# EAGLE design os23ac (EAGLE 9.6.2)
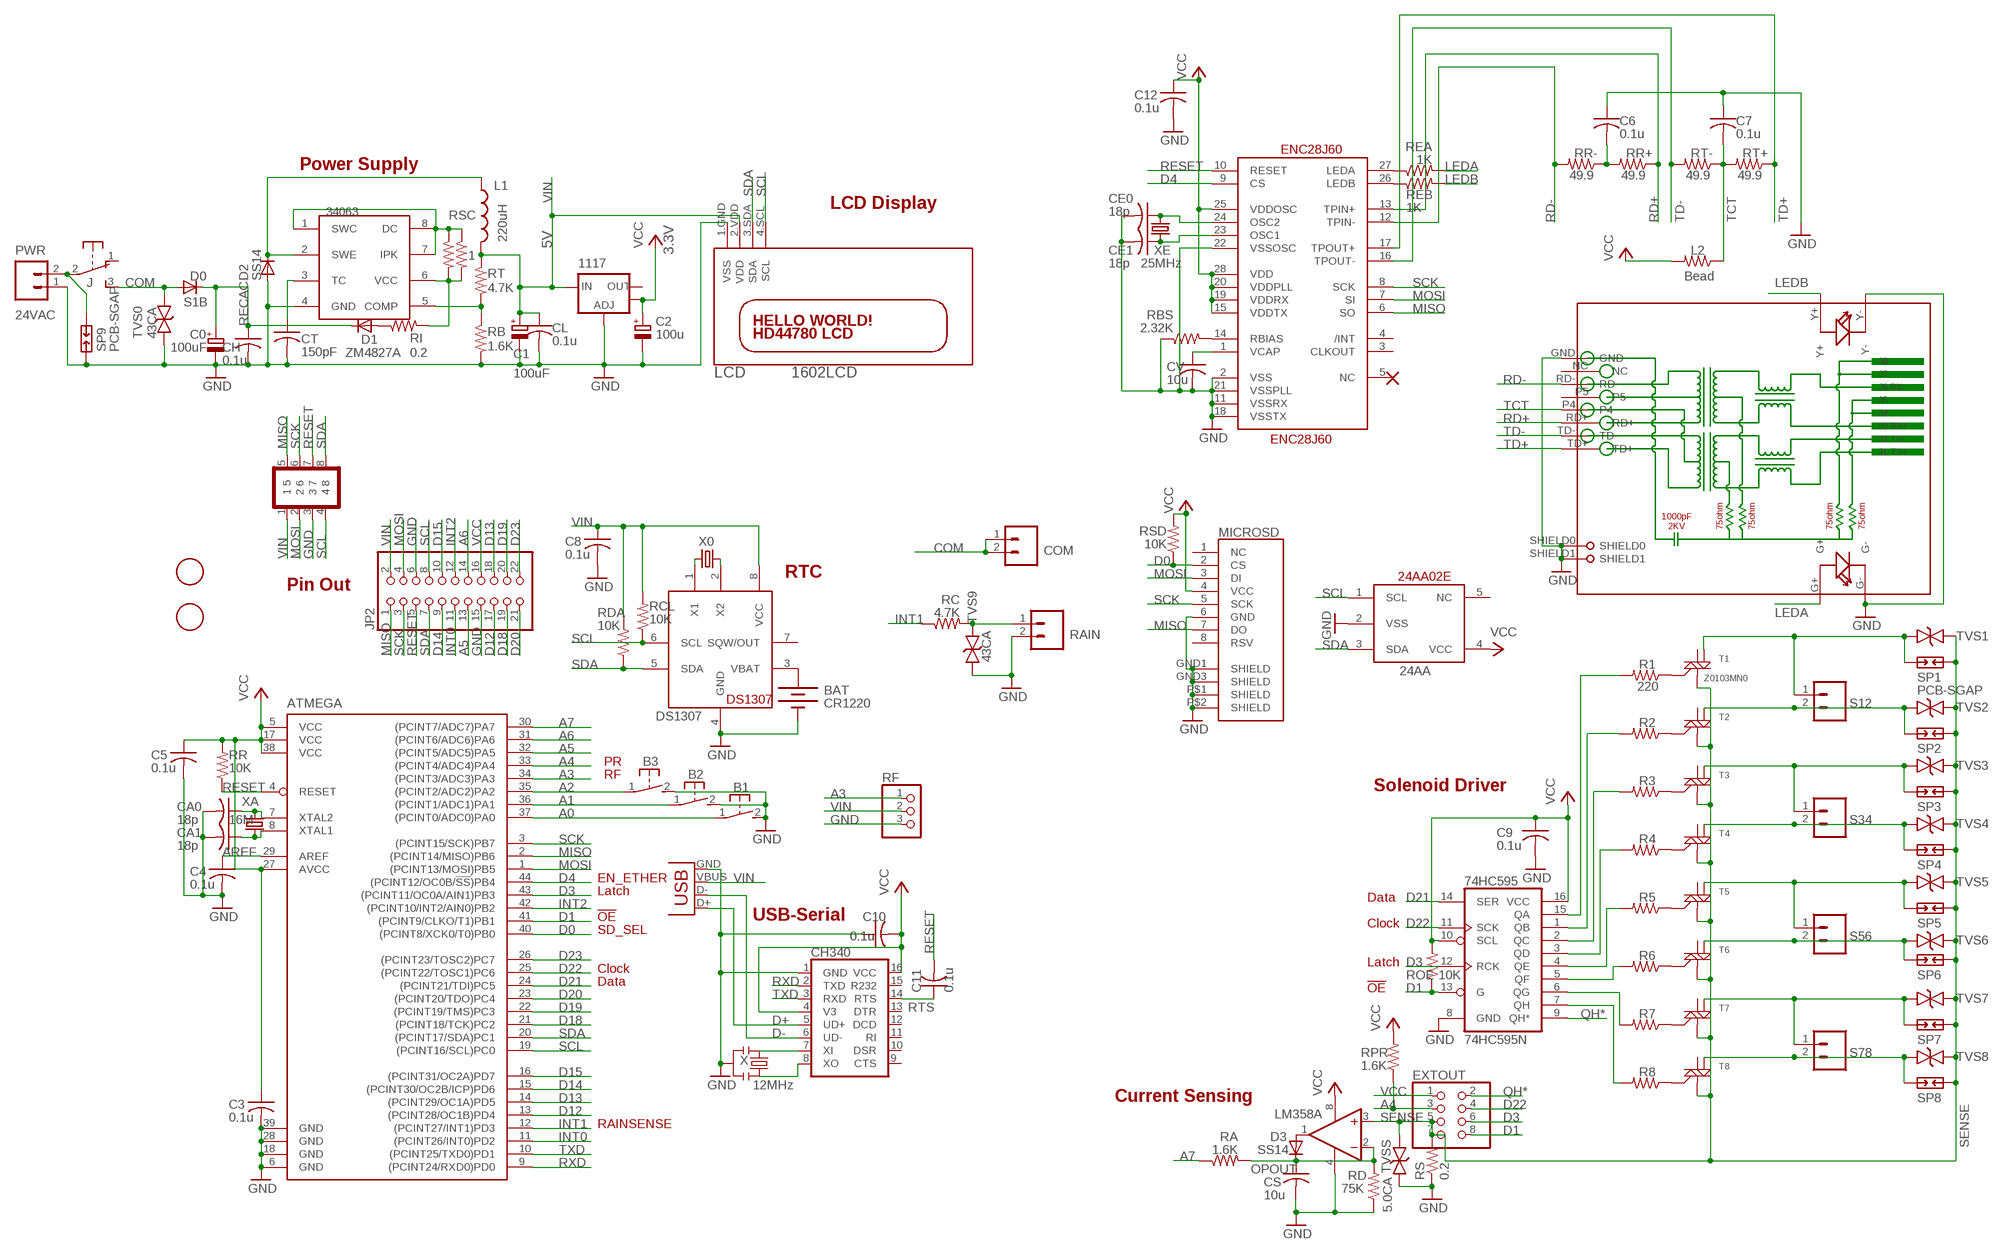
[diagram p0: schematic, sheet 1]

## Parts
24AA  24AA02E48  [SOT23-5L]
74HC595  74HC595N  74LS595D  [SO16]
1117  V_REG_LM1117SOT223  [SOT223]
34063  34063  MC33063/MC34063D  [SO08]
ATMEGA  ATMEGA644A  [TQFP44]
B1  31-XX  [B3F-31XX]
B2  31-XX  [B3F-31XX]
B3  31-XX  [B3F-31XX]
BAT  CR1220  BATTERYBATTERY_12MM_SMT  [BATTCON_12MM_SMT]
C0  100uF  CPOL-EUE  [PANASONIC_E]
C1  100uF  CPOL-EUD  [PANASONIC_D]
C2  100u  CPOL-EUD  [PANASONIC_D]
C3  0.1u  C-USC0603K  [C0603K]
C4  0.1u  C-USC0603  [C0603]
C5  0.1u  C-USC0603  [C0603]
C6  0.1u  C-USC0603  [C0603]
C7  0.1u  C-USC0603K  [C0603K]
C8  0.1u  C-USC0603  [C0603]
C9  0.1u  C-USC0603  [C0603]
C10  0.1u  C-USC0603  [C0603]
C11  0.1u  C-USC0603  [C0603]
C12  0.1u  C-USC0603  [C0603]
CA0  18p  C-USC0603K  [C0603K]
CA1  18p  C-USC0603K  [C0603K]
CE0  18p  C-USC0603K  [C0603K]
CE1  18p  C-USC0603K  [C0603K]
CH  0.1u  C-USC0603  [C0603]
CH340  CH340G  [SO16]
CL  0.1u  C-USC0603  [C0603]
COM  M025MM-X  [SCREWTERMINAL-5MM-2-X]
CS  10u  C-USC0805K  [C0805K]
CT  150pF  C-USC0603K  [C0603K]
CV  10u  C-USC0805K  [C0805K]
D0  S1B  DIODE-DO-214AC  [DO-214AC]
D1  ZM4827A  DIODE-MELF-MLL41  [MELF-MLL41]
D2  SS14  DIODE-DO-214AC  [DO-214AC]
D3  SS14  DIODE-DO-214AC  [DO-214AC]
DS1307  DS1307  DS1307SOIC  [SO08]
ENC28J60  ENC28J60SO28LONG  [SOIC28WLONG]
EXTOUT  PINHD-2X4  [2X04]
J  EG1206  [EG1206]
JP2  PINHD-2X11  [2X11]
L1  220uH  INDUCTORSRU1038  [SRU1038]
L2  Bead  R-US_R0805  [R0805]
LCD  1602LCD  HD44780LCD-I2CSIDE  [LCD1602-I2C-SIDE]
LM358  OP262D  [SO08]
MICROSD  USD-SOCKETMICRO-SD-SOCKET-TAOBAO  [MICRO-SD-SOCKET-TAOBAO]
PWR  24VAC  M024MM-X  [SCREWTERMINAL-4MM-2-X]
R1  220  R-US_R0603  [R0603]
R2  220  R-US_R0603  [R0603]
R3  220  R-US_R0603  [R0603]
R4  220  R-US_R0603  [R0603]
R5  220  R-US_R0603  [R0603]
R6  220  R-US_R0603  [R0603]
R7  220  R-US_R0603  [R0603]
R8  220  R-US_R0603  [R0603]
RA  1.6K  R-US_R0603  [R0603]
RAIN  M025MM-X  [SCREWTERMINAL-5MM-2-X]
RB  1.6K  R-US_R0603  [R0603]
RBS  2.32K  R-US_R0805  [R0805]
RC  4.7K  R-US_R0603  [R0603]
RCL  10K  R-US_R0603  [R0603]
RD  75K  R-US_R0603  [R0603]
RDA  10K  R-US_R0603  [R0603]
REA  1K  R-US_R0603  [R0603]
REB  1K  R-US_R0603  [R0603]
RF  PINHD-1X3  [1X03]
RI  0.2  R-US_R2512  [R2512]
RJ45  HR911105A  [HR911105A]
ROE  10K  R-US_R0603  [R0603]
RPR  1.6K  R-US_R0603  [R0603]
RR  10K  R-US_R0603  [R0603]
RR+  49.9  R-US_R0603  [R0603]
RR-  49.9  R-US_R0603  [R0603]
RS  0.2  R-US_R2512  [R2512]
RSC  1  R-US_R0805  [R0805]
RSC1  1  R-US_R0805  [R0805]
RSD  10K  R-US_R0603  [R0603]
RT  4.7K  R-US_R0805  [R0805]
RT+  49.9  R-US_R0603  [R0603]
RT-  49.9  R-US_R0603  [R0603]
S12  M025MM-X  [SCREWTERMINAL-5MM-2-X]
S34  M025MM-X  [SCREWTERMINAL-5MM-2-X]
S56  M025MM-X  [SCREWTERMINAL-5MM-2-X]
S78  M025MM-X  [SCREWTERMINAL-5MM-2-X]
SP1  PCB-SGAP  [PCB-SGAP]
SP2  PCB-SGAP  [PCB-SGAP]
SP3  PCB-SGAP  [PCB-SGAP]
SP4  PCB-SGAP  [PCB-SGAP]
SP5  PCB-SGAP  [PCB-SGAP]
SP6  PCB-SGAP  [PCB-SGAP]
SP7  PCB-SGAP  [PCB-SGAP]
SP8  PCB-SGAP  [PCB-SGAP]
SP9  PCB-SGAP  [PCB-SGAP]
T1  Z0103MN0  MAC97SOT223  [SOT223]
T2  Z0103MN  MAC97SOT223  [SOT223]
T3  Z0103MN  MAC97SOT223  [SOT223]
T4  Z0103MN  MAC97SOT223  [SOT223]
T5  Z0103MN  MAC97SOT223  [SOT223]
T6  Z0103MN  MAC97SOT223  [SOT223]
T7  Z0103MN  MAC97SOT223  [SOT223]
T8  Z0103MN  MAC97SOT223  [SOT223]
TVS0  43CA  DIODE-BTVSSMB  [SMB]
TVS1  40CA  DIODE-BTVSSMB  [SMB]
TVS2  40CA  DIODE-BTVSSMB  [SMB]
TVS3  40CA  DIODE-BTVSSMB  [SMB]
TVS4  40CA  DIODE-BTVSSMB  [SMB]
TVS5  40CA  DIODE-BTVSSMB  [SMB]
TVS6  40CA  DIODE-BTVSSMB  [SMB]
TVS7  40CA  DIODE-BTVSSMB  [SMB]
TVS8  40CA  DIODE-BTVSSMB  [SMB]
TVS9  43CA  DIODE-BTVSSMB  [SMB]
TVSS  5.0CA  DIODE-BTVSSMB  [SMB]
U$1  FIDUCIAL  [FIDUCIAL_1MM]
U$3  FIDUCIAL  [FIDUCIAL_1MM]
U$4  GOLDFINGER_2X4  [GOLDFINGER_2X4]
USB  USBPTH  [USB-B-PTH]
X  12MHz  RESONATORSMD  [RESONATOR-SMD]
X0  32.768kHz  CRYSTALMM20SS  [MM20SS]
XA  16M  CRYSTAL4SMD  [4SMD]
XE  25MHz  CRYSTAL4SMD  [4SMD]

## Nets
A0: ATMEGA.37((PCINT0/ADC0)PA0) B1.1(P)
A1: ATMEGA.36((PCINT1/ADC1)PA1) B2.1(P)
A2: ATMEGA.35((PCINT2/ADC2)PA2) B3.1(P)
A3: ATMEGA.34((PCINT3/ADC3)PA3) RF.1
A4: ATMEGA.33((PCINT4/ADC4)PA4) EXTOUT.3 RPR.1
A5: ATMEGA.32((PCINT5/ADC5)PA5) JP2.13
A6: ATMEGA.31((PCINT6/ADC6)PA6) JP2.14
A7: ATMEGA.30((PCINT7/ADC7)PA7) RA.1
AREF: ATMEGA.29(AREF) C4.1
COM [power]: COM.1 COM.2 D0.A J.3(S) TVS0.C
D0: ATMEGA.40((PCINT8/XCK0/T0)PB0) MICROSD.2(CS) RSD.1
D1: 74HC595.13(G) ATMEGA.41((PCINT9/CLKO/T1)PB1) EXTOUT.8 ROE.1
D3: 74HC595.12(RCK) ATMEGA.43((PCINT11/OC0A/AIN1)PB3) EXTOUT.6
D4: ATMEGA.44((PCINT12/OC0B/!SS!)PB4) ENC28J60.9(CS)
D12: ATMEGA.13((PCINT28/OC1B)PD4) JP2.17
D13: ATMEGA.14((PCINT29/OC1A)PD5) JP2.18
D14: ATMEGA.15((PCINT30/OC2B/ICP)PD6) JP2.9
D15: ATMEGA.16((PCINT31/OC2A)PD7) JP2.10
D18: ATMEGA.21((PCINT18/TCK)PC2) JP2.19
D19: ATMEGA.22((PCINT19/TMS)PC3) JP2.20
D20: ATMEGA.23((PCINT20/TDO)PC4) JP2.21
D21: 74HC595.14(SER) ATMEGA.24((PCINT21/TDI)PC5)
D22: 74HC595.11(SCK) ATMEGA.25((PCINT22/TOSC1)PC6) EXTOUT.4
D23: ATMEGA.26((PCINT23/TOSC2)PC7) JP2.22
D+: CH340.5(UD+) USB.D+
D-: CH340.6(UD-) USB.D-
GND: 24AA.2(VSS) 74HC595.8(GND) 1117.1(ADJ) 34063.4(GND) ATMEGA.6(GND) ATMEGA.18(GND) ATMEGA.28(GND) ATMEGA.39(GND) B1.2(S) B2.2(S) B3.2(S) BAT.P$1(-) C0.- C1.- C2.- C3.2 C4.2 C5.2 C6.1 C7.1 C8.2 C9.2 C10.1 C12.2 CA0.2 CA1.2 CE0.2 CE1.2 CH340.1(GND) CH.2 CL.2 CS.2 CT.2 CV.2 D2.A DS1307.4(GND) ENC28J60.2(VSS) ENC28J60.11(VSSRX) ENC28J60.18(VSSTX) ENC28J60.21(VSSPLL) ENC28J60.22(VSSOSC) JP2.6 JP2.15 LCD.1.GND(VSS) LM358.4(P:V-) MICROSD.6(GND) MICROSD.GND1(SHIELD) MICROSD.GND3(SHIELD) MICROSD.P$1(SHIELD) MICROSD.P$2(SHIELD) PWR.1 RAIN.2 RB.2 RBS.1 RD.1 RF.3 RJ45.G- RJ45.GND RJ45.SHIELD0 RJ45.SHIELD1 RJ45.Y- RS.1 SP9.2 TVS0.A TVS9.A TVSS.A U$4.3 USB.GND X.2
INT0: ATMEGA.11((PCINT26/INT0)PD2) JP2.11
INT1: ATMEGA.12((PCINT27/INT1)PD3) RC.1
INT2: ATMEGA.42((PCINT10/INT2/AIN0)PB2) JP2.12
LEDA: REA.2 RJ45.G+
LEDB: REB.2 RJ45.Y+
MISO: ATMEGA.2((PCINT14/MISO)PB6) ENC28J60.6(SO) JP2.1 MICROSD.7(DO) U$4.5
MOSI: ATMEGA.1((PCINT13/MOSI)PB5) ENC28J60.7(SI) JP2.4 MICROSD.3(DI) U$4.2
N$1 [power]: J.2(P) PWR.2 SP9.1
N$2 [power]: 34063.1(SWC) 34063.7(IPK) 34063.8(DC) RSC1.1 RSC.1
N$3: RAIN.1 RC.2 TVS9.C
N$4: 74HC595.5(QF) R6.2
N$5: 74HC595.6(QG) R7.2
N$6: CH340.7(XI) X.1
N$7: 74HC595.7(QH) R8.2
N$8: DS1307.1(X1) X0.1
N$9 [power]: 34063.2(SWE) D2.C L1.1
N$10: 74HC595.4(QE) R5.2
N$11: 74HC595.3(QD) R4.2
N$12: 74HC595.2(QC) R3.2
N$13: 74HC595.1(QB) R2.2
N$14: 74HC595.15(QA) R1.2
N$15: ATMEGA.7(XTAL2) CA0.1 XA.1
N$16 [power]: S12.1 SP1.2 T1.4(M2-4) TVS1.A
N$17 [power]: S12.2 SP2.2 T2.4(M2-4) TVS2.A
N$18 [power]: S34.1 SP3.2 T3.4(M2-4) TVS3.A
N$19: ATMEGA.8(XTAL1) CA1.1 XA.3
N$20 [power]: S34.2 SP4.2 T4.4(M2-4) TVS4.A
N$21: 34063.3(TC) CT.1
N$22 [power]: S56.1 SP5.2 T5.4(M2-4) TVS5.A
N$23 [power]: S56.2 SP6.2 T6.4(M2-4) TVS6.A
N$24 [power]: S78.1 SP7.2 T7.4(M2-4) TVS7.A
N$25 [power]: S78.2 SP8.2 T8.4(M2-4) TVS8.A
N$26 [power]: 34063.6(VCC) RI.2 RSC1.2 RSC.2
N$27: D1.A RI.1
N$28: R1.1 T1.3(G)
N$29: R2.1 T2.3(G)
N$30: DS1307.2(X2) X0.4
N$31: R3.1 T3.3(G)
N$32: R4.1 T4.3(G)
N$33: R5.1 T5.3(G)
N$34: ENC28J60.27(LEDA) REA.1
N$35: R6.1 T6.3(G)
N$36: BAT.P$2(+) DS1307.3(VBAT)
N$37: ENC28J60.26(LEDB) REB.1
N$38: R7.1 T7.3(G)
N$39: CV.1 ENC28J60.1(VCAP)
N$40: CH340.8(XO) X.3
N$41: CE0.1 ENC28J60.24(OSC2) XE.3
N$42: CE1.1 ENC28J60.23(OSC1) XE.1
N$43: D3.A LM358.1(A:OUT)
N$44: R8.1 T8.3(G)
N$54: C6.2 RR+.2 RR-.1
N$55: 34063.5(COMP) RB.1 RT.2
N$59: ENC28J60.14(RBIAS) RBS.2
OPOUT: CS.1 D3.C LM358.2(A:-IN) RA.2 RD.2
QH*: 74HC595.9(QH*) EXTOUT.2
RD+: ENC28J60.13(TPIN+) RJ45.RD+ RR+.1
RD-: ENC28J60.12(TPIN-) RJ45.RD- RR-.2
RECAC [power]: C0.+ CH.1 D0.C D1.C
RESET: ATMEGA.4(RESET) C11.2 ENC28J60.10(RESET) JP2.5 RR.1 U$4.7
RTS: C11.1 CH340.14(RTS)
RXD: ATMEGA.9((PCINT24/RXD0)PD0) CH340.2(TXD)
SCK: ATMEGA.3((PCINT15/SCK)PB7) ENC28J60.8(SCK) JP2.3 MICROSD.5(SCK) U$4.6
SCL: 24AA.1(SCL) ATMEGA.19((PCINT16/SCL)PC0) DS1307.6(SCL) JP2.8 LCD.4.SCL(SCL) RCL.1 U$4.4
SDA: 24AA.3(SDA) ATMEGA.20((PCINT17/SDA)PC1) DS1307.5(SDA) JP2.7 LCD.3.SDA(SDA) RDA.1 U$4.8
SENSE: EXTOUT.5 EXTOUT.7 LM358.3(A:+IN) RS.2 SP1.1 SP2.1 SP3.1 SP4.1 SP5.1 SP6.1 SP7.1 SP8.1 T1.1(M1) T2.1(M1) T3.1(M1) T4.1(M1) T5.1(M1) T6.1(M1) T7.1(M1) T8.1(M1) TVS1.C TVS2.C TVS3.C TVS4.C TVS5.C TVS6.C TVS7.C TVS8.C TVSS.C
TCT: C7.2 L2.1 RJ45.P4 RT+.2 RT-.1
TD+: ENC28J60.17(TPOUT+) RJ45.TD+ RT+.1
TD-: ENC28J60.16(TPOUT-) RJ45.TD- RT-.2
TXD: ATMEGA.10((PCINT25/TXD0)PD1) CH340.3(RXD)
VCC: 24AA.4(VCC) 74HC595.10(SCL) 74HC595.16(VCC) 1117.4(OUT) ATMEGA.5(VCC) ATMEGA.17(VCC) ATMEGA.27(AVCC) ATMEGA.38(VCC) C2.+ C3.1 C5.1 C9.1 C10.2 C12.1 CH340.4(V3) CH340.16(VCC) ENC28J60.15(VDDTX) ENC28J60.19(VDDRX) ENC28J60.20(VDDPLL) ENC28J60.25(VDDOSC) ENC28J60.28(VDD) EXTOUT.1 JP2.16 L2.2 LM358.8(P:V+) MICROSD.4(VCC) ROE.2 RPR.2 RR.2 RSD.2
VIN [power]: 1117.3(IN) C1.+ C8.1 CL.1 DS1307.8(VCC) JP2.2 L1.2 LCD.2.VDD(VDD) RCL.2 RDA.2 RF.2 RT.1 U$4.1 USB.VBUS
Unconnected: 24AA.5(NC) 1117.2(OUT) CH340.9(CTS) CH340.10(DSR) CH340.11(RI) CH340.12(DCD) CH340.13(DTR) CH340.15(R232) DS1307.7(SQW/OUT) ENC28J60.3(CLKOUT) ENC28J60.4(/INT) ENC28J60.5(NC) J.1(O) LM358.5(B:+IN) LM358.6(B:-IN) LM358.7(B:OUT) MICROSD.1(NC) MICROSD.8(RSV) RJ45.NC RJ45.P5 T1.2(M2) T2.2(M2) T3.2(M2) T4.2(M2) T5.2(M2) T6.2(M2) T7.2(M2) T8.2(M2)

## Notes on the sheet
- Power Supply
- LCD Display
- 5V
- 3.3V
- RTC
- Pin Out
- PR
- RF
- Solenoid Driver
- EN_ETHER
- Latch
- Data
- !OE | USB-Serial
- Clock
- SD_SEL
- Latch
- Clock
- Data
- !OE
- Current Sensing
- RAINSENSE

## Library data of the parts
24AA = adafruit:24AA02E48
74HC595 = SparkFun:74*595: 8-bit SHIFT REGISTER, output latch
1117 = SparkFun:V_REG_LM1117: Voltage Regulator LM1117 Standard adjustable voltage regulator but in SMD form. Spark Fun Electronics SKU : COM-00595
34063 = adafruit:MC33063/MC34063: MC33063 and MC34063 Basic DC/DC converter with internal power-NPN transistor, 100KHz, 1.5A peak switch current. 3-40 input/output.
ATMEGA = atmel:ATMEGA644: 8-bit Microcontroller with 64K Bytes In-System Programmable Flash Source: http://www.atmel.com/dyn/resources/prod_documents/doc2593.pdf; MPN: ATMEGA644PV-10AU; OC_FARNELL: 1455123; OC_NEWARK: 58M3748
B1-B3 = adafruit:31-XX: OMRON SWITCH Now with beefier pads!
BAT = SparkFunNew:BATTERY: Battery Holders Various common sizes : AA, AAA, 20mm coin cell and 12mm coin cell.
C0 C1 C2 = resistor:CPOL-EU: POLARIZED CAPACITOR, European symbol
C3-C12 CA0 CA1 CE0 CE1 CH CL CS CT CV = adafruit:C-US: CAPACITOR, American symbol
CH340 = SparkFunNew:CH340
COM PWR RAIN S12 S34 S56 S78 = SparkFun:M02: Header 2 Standard 2-pin 0.1" header. Use with straight break away headers (SKU : PRT-00116), right angle break away headers (PRT-00553), swiss pins (PRT-00743), machine pins (PRT-00117), and female headers (PRT-00115). Molex polarized connector foot print use with SKU : PRT-08233 with associated crimp pins and housings.
D0 D1-D3 = diode:DIODE-: DIODE
DS1307 = adafruit:DS1307: DS1307 Real time clock (RTC) with battery backup ability. Talk to it via i2c
ENC28J60 = SparkFun:ENC28J60
EXTOUT = pinhead:PINHD-2X4: PIN HEADER
J = adafruit:EG1206
JP2 = pinhead:PINHD-2X11: PIN HEADER
L1 = SparkFunNew:INDUCTOR: Inductors Basic Inductor/Choke - 0603 and 1206. Footprints are not proven and vary greatly between part numbers.
L2 R1-R8 RA RC RCL RD RDA ROE RPR RR RS RSD = adafruit2013:R-US_: RESISTOR, American symbol
LCD = adafruit:HD44780LCD-I2C
LM358 = linear:OP262: OP AMP
MICROSD = SparkFunNew:USD-SOCKET: microSD Socket Push-push type uSD socket. Schematic element and footprint production proven. Spark Fun Electronics SKU : PRT-00127. tDoc lines correctly indicate media card edge positions when inserting (unlocked, locked, depressed).
RB RBS REA REB RI RR+ RR- RSC RSC1 RT RT+ RT- = adafruitGood:R-US_: RESISTOR, American symbol
RF = pinhead:PINHD-1X3: PIN HEADER
RJ45 = CONNECTER:HR911105A
SP1-SP9 = varistor:PCB-SGAP
T1-T8 = SparkFun:MAC97: MAC97 Triac http://www.onsemi.com/pub_link/Collateral/MAC97-D.PDF
TVS0 TVS1-TVS9 TVSS = diode:DIODE-BTVS
U$1 U$3 = adafruitGood:FIDUCIAL: For use by pick and place machines to calibrate the vision/machine, 1mm By microbuilder.eu
U$4 = SparkFunNew:GOLDFINGER_2X4
USB = SparkFunNew:USB: USB Connectors USB-B-PTH is fully proven SKU : PRT-00139 USB-miniB is fully proven SKU : PRT-00587 USB-A-PCB is untested. USB-A-H is throughly reviewed, but untested. Spark Fun Electronics SKU : PRT-00437 USB-B-SMT is throughly reviewed, but untested. Needs silkscreen touching up. USB-A-S has not been used/tested USB-MB-H has not been used/tested
X = SparkFunNew:RESONATOR: Resonator Small SMD resonator. This is the itty bitty 10/20MHz resonators with built in caps. CSTCE10M0G55 and CSTCE20M0V53. Footprint has been reviewed closely but hasn't been tested yet.
X0 = crystal:CRYSTAL: CRYSTAL; OC_FARNELL: unknown; OC_NEWARK: unknown
XA XE = adafruit_3:CRYSTAL: CRYSTAL

## Net classes
0 default: width 0.203 mm, clearance 0.178 mm
1 power: width 0.305 mm, clearance 0.178 mm
2 relaypower: width 0.813 mm, clearance 0.406 mm

## Board
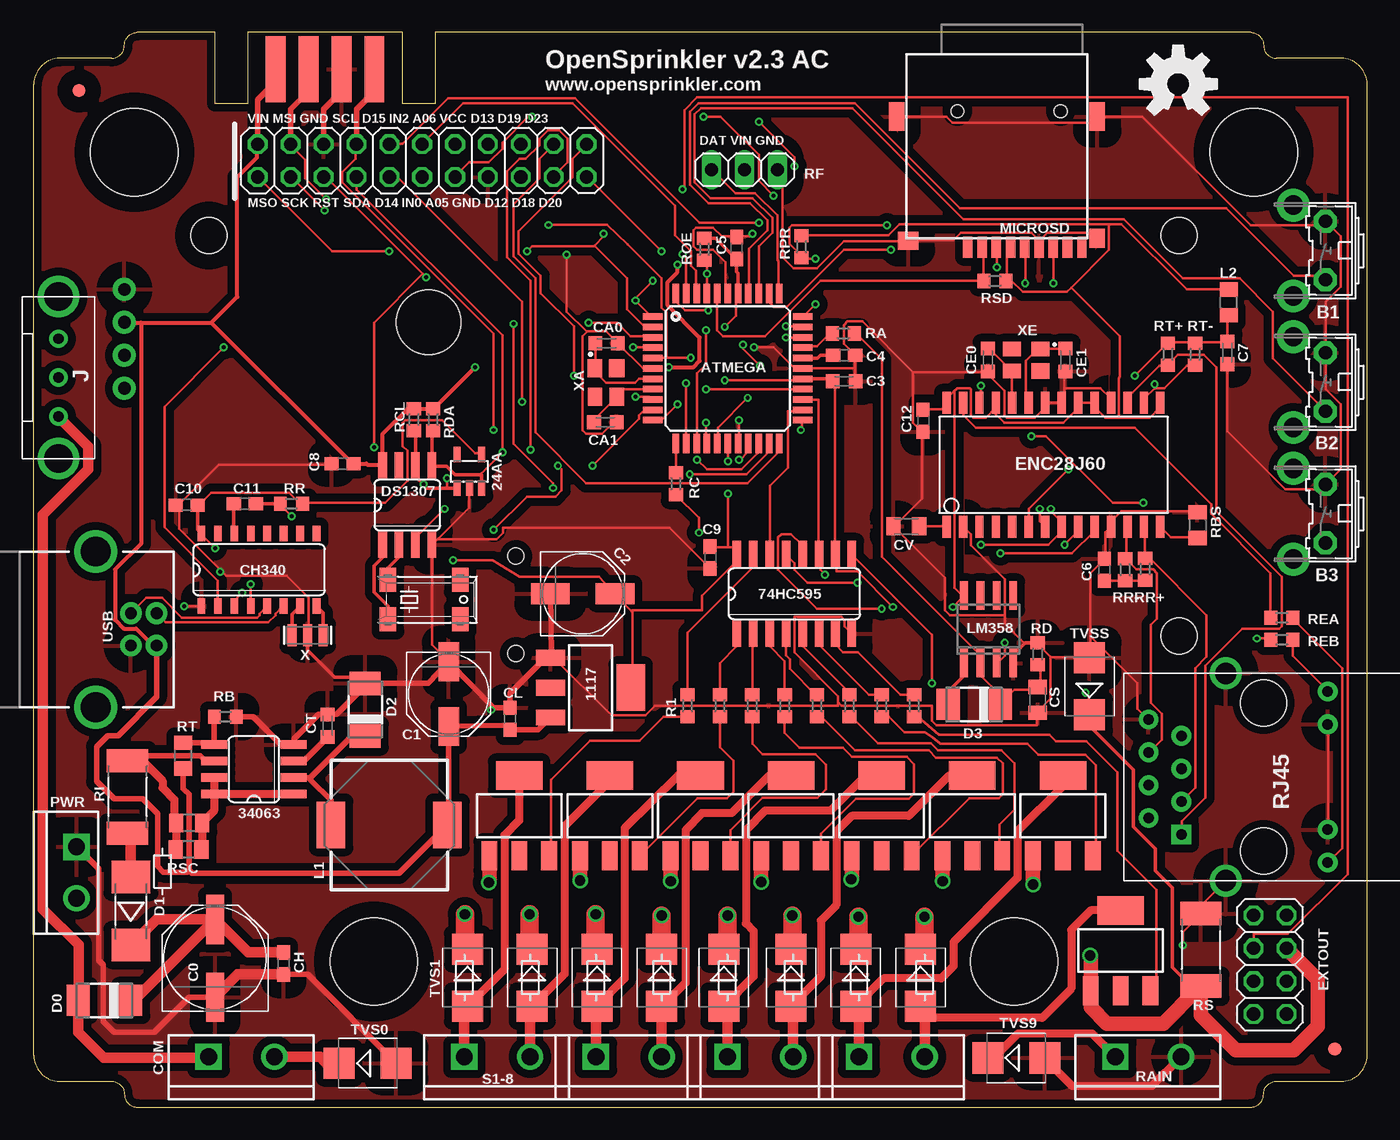
[diagram p1: board, top side]
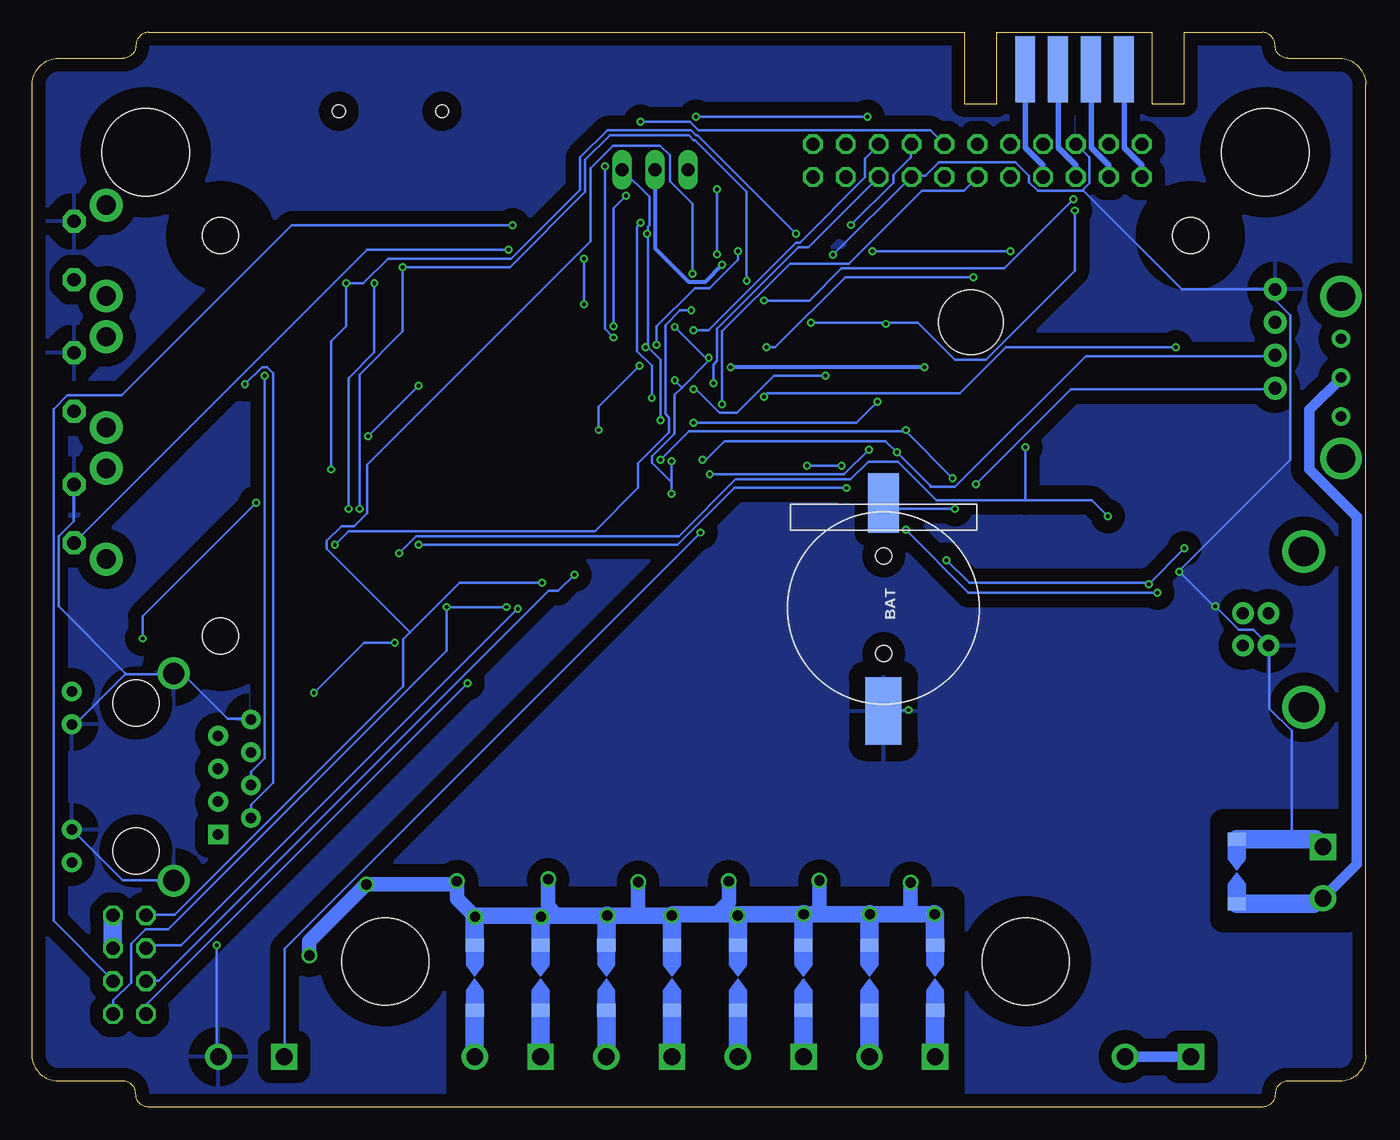
[diagram p2: board, bottom side, seen from below]

Size 103 x 83 mm. Coordinates in mm from the lower left corner, seen from the top.
Outline: 101,81 96,81 arc-90 95,82 arc90 94,83 31,83 31,77.5 28.5,77.5 28.5,83 16.5,83 16.5,77.5 14,77.5 14,83 8,83 arc90 7,82 arc-90 6,81 2,81 arc90 0,79 0,4 arc90 2,2 6,2 arc-90 7,1 arc90 8,0 94,0 arc90 95,1 arc-90 96,2 101,2 arc90 103,4 103,79 arc90 101,81
Copper layers (1*16): Top 0.035mm / dielectric 1.5mm / Bottom 0.035mm
Design rules "Fusion_eagle_rule_v1.1 *": minimum track width 6mil, minimum drill 12mil, track to track 6mil, track to pad 6mil, pad to pad 6mil, via to via 6mil, smd to smd 0mil, copper to edge 10mil, drill to drill 10mil, minimum pad ring 10mil, minimum via ring 6mil, stop-mask expansion 2mil, vias tented up to drill 100mil, thermal gap 50mil
Holes 6.75 mm at 7.76,73.74 94.24,73.74 26.26,11.26 75.74,11.26
Holes 5 mm at 30.5,60.6
tRestrict: area 3.8,69.7 to 11.8,77.7; area 90.2,69.7 to 98.2,77.7; area 22.3,7.3 to 30.3,15.3; area 71.7,7.3 to 79.7,15.3
bRestrict: area 3.8,69.7 to 11.8,77.7; area 90.2,69.7 to 98.2,77.7; area 22.3,7.3 to 30.3,15.3; area 71.7,7.3 to 79.7,15.3; area 32,0 to 70,16; area 1.5,14.5 to 11,22

### Footprints (pad centres in the part's own frame; a part is rotated, then mirrored left to right if it is on the bottom)
SOT23-5L = smd 0.55 x 1.2: 1 -0.95,-1.3; 2 0,-1.3; 3 0.95,-1.3; 4 0.95,1.3; 5 -0.95,1.3
SO16 = smd 0.66 x 2.032: 1 -4.445,-3.073; 2 -3.175,-3.073; 3 -1.905,-3.073; 4 -0.635,-3.073; 5 0.635,-3.073; 6 1.905,-3.073; 7 3.175,-3.073; 8 4.445,-3.073; 9 4.445,3.073; 10 3.175,3.073; 11 1.905,3.073; 12 0.635,3.073; 13 -0.635,3.073; 14 -1.905,3.073; 15 -3.175,3.073; 16 -4.445,3.073
SOT223 = smd 1.219 x 2.235: 1 -2.311,-3.099; 2 0,-3.099; 3 2.311,-3.099 | smd 3.6 x 2.2: 4 0,3.099
SO08 = smd 0.66 x 2.032: 1 -1.905,-3.073; 2 -0.635,-3.073; 3 0.635,-3.073; 4 1.905,-3.073; 5 1.905,3.073; 6 0.635,3.073; 7 -0.635,3.073; 8 -1.905,3.073
TQFP44 = smd 1.5 x 0.5: 1 -5.8,4; 2 -5.8,3.2; 3 -5.8,2.4; 4 -5.8,1.6; 5 -5.8,0.8; 6 -5.8,0; 7 -5.8,-0.8; 8 -5.8,-1.6; 9 -5.8,-2.4; 10 -5.8,-3.2; 11 -5.8,-4; 23 5.8,-4; 24 5.8,-3.2; 25 5.8,-2.4; 26 5.8,-1.6; 27 5.8,-0.8; 28 5.8,0; 29 5.8,0.8; 30 5.8,1.6; 31 5.8,2.4; 32 5.8,3.2; 33 5.8,4 | smd 0.5 x 1.5: 12 -4,-5.8; 13 -3.2,-5.8; 14 -2.4,-5.8; 15 -1.6,-5.8; 16 -0.8,-5.8; 17 0,-5.8; 18 0.8,-5.8; 19 1.6,-5.8; 20 2.4,-5.8; 21 3.2,-5.8; 22 4,-5.8; 34 4,5.8; 35 3.2,5.8; 36 2.4,5.8; 37 1.6,5.8; 38 0.8,5.8; 39 0,5.8; 40 -0.8,5.8; 41 -1.6,5.8; 42 -2.4,5.8; 43 -3.2,5.8; 44 -4,5.8
B3F-31XX = drill 1.016 pad 1.778 octagon: 1 -2.261,-1.245; 2 2.261,-1.245 | drill 1.499 pad 2.54: 3 -3.505,1.245; 4 3.505,1.245
BATTCON_12MM_SMT = smd 2.8 x 5.2: P$1 0,11.96 | smd 2.4 x 4.6: P$2 0,-4.1 | hole 1.25: 0,7.5; 0,0
PANASONIC_E = smd 3.8 x 1.4: + 3,0; - -3,0
PANASONIC_D = smd 3 x 1.6: + 2.5,0; - -2.5,0
C0603K = smd 1.05 x 1.08: 1 -0.875,0; 2 0.875,0
C0603 = smd 1.1 x 1: 1 -0.85,0; 2 0.85,0
SO16' = smd 0.6 x 1.2: 1 -4.445,-2.8; 2 -3.175,-2.8; 3 -1.905,-2.8; 4 -0.635,-2.8; 5 0.635,-2.8; 6 1.905,-2.8; 7 3.175,-2.8; 8 4.445,-2.8; 9 4.445,2.8; 10 3.175,2.8; 11 1.905,2.8; 12 0.635,2.8; 13 -0.635,2.8; 14 -1.905,2.8; 15 -3.175,2.8; 16 -4.445,2.8
SCREWTERMINAL-5MM-2-X = drill 1.3 pad 2.032 square: 1 0,0 | drill 1.3 pad 2.032: 2 5.08,0
C0805K = smd 1.1 x 1.4: 1 -1,0; 2 1,0
DO-214AC = smd 1.8 x 2.4: A 2.025,0; C -2.025,0
MELF-MLL41 = smd 2.5 x 3: A 2.625,0; C -2.625,0
SOIC28WLONG = smd 0.65 x 1.7: 1 -8.89,-4.78; 2 -7.62,-4.78; 3 -6.35,-4.78; 4 -5.08,-4.78; 5 -3.81,-4.78; 6 -2.54,-4.78; 7 -1.27,-4.78; 8 0,-4.78; 9 1.27,-4.78; 10 2.54,-4.78; 11 3.81,-4.78; 12 5.08,-4.78; 13 6.35,-4.78; 14 7.62,-4.78; 15 7.62,4.78; 16 6.35,4.78; 17 5.08,4.78; 18 3.81,4.78; 19 2.54,4.78; 20 1.27,4.78; 21 0,4.78; 22 -1.27,4.78; 23 -2.54,4.78; 24 -3.81,4.78; 25 -5.08,4.78; 26 -6.35,4.78; 27 -7.62,4.78; 28 -8.89,4.78
2X04 = drill 1.016 octagon: 1 -3.81,-1.27; 2 -3.81,1.27; 3 -1.27,-1.27; 4 -1.27,1.27; 5 1.27,-1.27; 6 1.27,1.27; 7 3.81,-1.27; 8 3.81,1.27
EG1206 = drill 0.8 pad 1.422: 1 -3,0; 2 0,0; 3 3,0 | drill 2.2: MT1 -6.25,0; MT2 6.25,0
2X11 = drill 1.016 octagon: 1 -12.7,-1.27; 2 -12.7,1.27; 3 -10.16,-1.27; 4 -10.16,1.27; 5 -7.62,-1.27; 6 -7.62,1.27; 7 -5.08,-1.27; 8 -5.08,1.27; 9 -2.54,-1.27; 10 -2.54,1.27; 11 0,-1.27; 12 0,1.27; 13 2.54,-1.27; 14 2.54,1.27; 15 5.08,-1.27; 16 5.08,1.27; 17 7.62,-1.27; 18 7.62,1.27; 19 10.16,-1.27; 20 10.16,1.27; 21 12.7,-1.27; 22 12.7,1.27
SRU1038 = smd 2.2 x 3.6: 1 -4.5,0; 2 4.5,0
R0805 = smd 1.1 x 1.4: 1 -1,0; 2 1,0
LCD1602-I2C-SIDE = drill 1 pad 1.778: 1.GND -4,29.3; 2.VDD -4,26.76; 3.SDA -4,24.22; 4.SCL -4,21.68 | hole 2.8: 2.54,33.46; 77.46,33.46; 77.46,2.54
SO08' = smd 0.6 x 2.2: 1 -1.905,-2.6; 2 -0.635,-2.6; 3 0.635,-2.6; 4 1.905,-2.6; 5 1.905,2.6; 6 0.635,2.6; 7 -0.635,2.6; 8 -1.905,2.6
MICRO-SD-SOCKET-TAOBAO = smd 0.75 x 1.6: 1 2.25,10.5; 2 1.15,10.5; 3 0.05,10.5; 4 -1.05,10.5; 5 -2.15,10.5; 6 -3.25,10.5; 7 -4.35,10.5; 8 -5.45,10.5 | smd 0.7 x 1.6: CD -6.55,10.5 | smd 1.2 x 1.5: GND1 -7.75,9.8 | smd 1.6 x 1.4: GND3 6.85,10 | smd 1.2 x 2.2: P$1 7.75,0.4; P$2 -7.75,0.4 | hole 1: 3.05,0; -4.93,0
SCREWTERMINAL-4MM-2-X = drill 1.3 pad 2.032 square: 1 0,0 | drill 1.3 pad 2.032: 2 3.96,0
R0603 = smd 1 x 1.1: 1 -0.85,0; 2 0.85,0
1X03 = drill 1.016 long: 1 -2.54,0; 2 0,0; 3 2.54,0
R2512 = smd 1.8 x 3.2: 1 -2.8,0; 2 2.8,0
HR911105A = drill 0.813 pad 1.524: G+ 4.953,-6.604; G- 4.953,-4.064; GND -8.89,4.445; NC -6.35,3.175; P4 -8.89,-0.635; P5 -6.35,0.635; RD+ -6.35,-1.905; RD- -8.89,1.905; TD- -8.89,-3.175; Y+ 4.953,6.604; Y- 4.953,4.064 | drill 1.651 pad 2.159: SHIELD0 -2.921,8.001; SHIELD1 -2.921,-8.001 | drill 0.813 pad 1.524 square: TD+ -6.35,-4.445 | hole 3.556: 0,-5.715; 0,5.715
PCB-SGAP = smd 1 x 1.4 bottom: 1 -2.5,0; 2 2.5,0
SMB = smd 2.4 x 2.4: A 2.2,0; C -2.2,0
FIDUCIAL_1MM = smd 1 x 1: 1 0,0
GOLDFINGER_2X4 = smd 1.524 x 5.08: 1 -3.81,-2.54; 2 -1.27,-2.54; 3 1.27,-2.54; 4 3.81,-2.54 | smd 1.524 x 5.08 bottom: 5 -3.81,-2.54; 6 -1.27,-2.54; 7 1.27,-2.54; 8 3.81,-2.54
USB-B-PTH = drill 0.914 pad 1.676: D+ 0,1.25; D- 1.981,1.25; GND 0,-1.25; VBUS 1.981,-1.25 | drill 2.286: S1 -2.718,-6.02; S2 -2.718,6.02
RESONATOR-SMD = smd 0.7 x 1.7: 1 -1.2,0; 2 0,0; 3 1.2,0
MM20SS = smd 1.27 x 1.88: 1 -2.794,-1.524; 2 2.794,-1.524; 3 2.794,1.524; 4 -2.794,1.524
4SMD = smd 1.4 x 1.12: 1 -1.1,-0.85; 3 1.1,0.85 | smd 1.4 x 1.1: 2 1.1,-0.85 | smd 1.4 x 1.2: 4 -1.1,0.85

### Placement (x,y rotation side)
24AA  33.65,49.1 0 top
74HC595  58.75,39.65 0 top
1117  43,32.4 270 top
34063  17,26.1 90 top
ATMEGA  53.6,57.05 0 top
B1  98.54,66.15 90 top
B2  98.54,55.99 90 top
B3  98.54,45.83 90 top
BAT  37.25,42.55 180 bottom
C0  14,11.5 90 top
C1  32.05,31.9 270 top
C2  42.4,39.65 0 top
C3  62.6,56.05 0 top
C4  62.6,58.05 0 top
C5  54.3,66.35 90 top
C6  82.7,41.5 270 top
C7  92.2,58.25 90 top
C8  23.85,49.7 180 top
C9  52.25,42.45 270 top
C10  11.8,46.5 0 top
C11  16.3,46.6 0 top
C12  68.7,53 270 top
CA0  44.25,59 0 top
CA1  44.15,52.9 0 top
CE0  73.7,57.7 270 top
CE1  79.7,57.7 270 top
CH  19.3,11.1 270 top
CH340  [SO16']  17.4,41.5 0 top
CL  36.8,30 90 top
COM  13.5,3.9 0 top
CS  77.55,31.45 270 top
CT  22.7,29.45 90 top
CV  67.4,44.85 180 top
D0  5.45,8.25 180 top
D1  7.5,15.15 90 top
D2  25.6,30.7 90 top
D3  72.65,31.1 180 top
DS1307  28.85,46.5 0 top
ENC28J60  79.4,49.6 0 top
EXTOUT  95.5,11 90 top
J  1.9,56.34 270 top
JP2  30,73.1 0 top
L1  27.45,21.8 0 top
L2  92.3,62.15 90 top
LCD  11,33.84 0 top
LM358  [SO08']  73.75,36.9 0 top
MICROSD  74.4,76.9 180 top
PWR  3.3,20.1 270 top
R1  50.5,31 90 top
R2  53,31 90 top
R3  55.5,31 90 top
R4  58,31 90 top
R5  60.5,31 90 top
R6  63,31 90 top
R7  65.5,31 90 top
R8  68,31 90 top
RA  62.55,59.75 0 top
RAIN  83.55,3.9 0 top
RB  14.8,30.15 0 top
RBS  89.9,44.95 270 top
RC  49.6,48.15 270 top
RCL  29.35,53.1 90 top
RD  77.55,35 270 top
RDA  30.85,53.1 90 top
REA  96.4,37.8 0 top
REB  96.4,36.1 0 top
RF  54.9,72.4 0 top
RI  7.25,23.95 90 top
RJ45  95,25.5 0 top
ROE  51.8,66.25 90 top
RPR  59.3,66.45 90 top
RR  19.9,46.6 0 top
RR+  85.85,41.55 270 top
RR-  84.3,41.5 90 top
RS  90.15,12.15 270 top
RSC  11.95,19.9 180 top
RSC1  12,21.95 180 top
RSD  74.25,63.8 0 top
RT  11.55,27.15 90 top
RT+  87.6,58.15 90 top
RT-  89.7,58.15 270 top
S12  33.26,3.9 0 top
S34  43.42,3.9 0 top
S56  53.58,3.9 0 top
S78  63.74,3.9 0 top
SP1  33.26,10 270 top
SP2  38.34,10 270 top
SP3  43.42,10 270 top
SP4  48.5,10 270 top
SP5  53.58,10 270 top
SP6  58.66,10 270 top
SP7  63.74,10 270 top
SP8  68.82,10 270 top
SP9  9.95,18.2 90 top
T1  37.5,22.5 0 top
T2  44.5,22.5 0 top
T3  51.5,22.5 0 top
T4  58.5,22.5 0 top
T5  65.5,22.5 0 top
T6  72.5,22.5 0 top
T7  79.5,22.5 0 top
T8  83.95,12.1 0 top
TVS0  25.8,3.4 0 top
TVS1  33.5,10 270 top
TVS2  38.5,10 270 top
TVS3  43.5,10 270 top
TVS4  48.5,10 270 top
TVS5  53.3,10 270 top
TVS6  58.5,10 270 top
TVS7  63.5,10 270 top
TVS8  68.5,10 270 top
TVS9  75.9,3.8 0 top
TVSS  81.55,32.5 90 top
U$1  3.5,78.5 90 top
U$3  100.5,4.5 0 top
U$4  22.5,82.7 0 top
USB  7.5,36.9 0 top
X  21.15,36.45 0 top
X0  30.15,39.2 0 top
XA  44.2,55.95 270 top
XE  76.65,57.7 180 top

### Tracks (layer width: path | path; a pad name or v marks a point on that pad's centre or on a via)
A0
  Top 0.203: ATMEGA.37 55.24,62.87 55.24,66.29 56.67,67.72 56.67,68.48 55.34,69.82 52.1,69.82 50.67,71.25 50.67,76.87 51.34,77.53 63.44,77.53 71.53,69.44 92.11,69.44 97.35,64.2 99.44,64.2 99.73,63.91 B1.1
A1
  Top 0.203: ATMEGA.36 56.01,62.87 56.01,66.48 57.05,67.53 57.05,68.67 55.53,70.2 52.29,70.2 51.05,71.44 51.05,76.68 51.53,77.15 63.25,77.15 71.82,68.58 84.2,68.58 88.77,64.01 93.15,64.01 95.73,61.44 95.73,57.82 99.73,53.82 B2.1
A2  (via drill 0.3)
  Top 0.203: v66.2,66.2 62.58,66.2 58.2,61.82 57.15,61.82 56.86,62.1 56.86,62.77 ATMEGA.35
  Bottom 0.203: v66.2,66.2 77.15,66.2 99.73,43.62 B3.1
A3
  Top 0.203: ATMEGA.34 57.53,62.87 57.53,65.34 57.44,65.44 57.44,68.86 55.72,70.58 54.2,70.58 52.39,72.39 RF.1
A4  (via drill 0.3)
  Top 0.203: v60.39,65.53 59.34,65.53 RPR.1 59.24,65.63 59.24,65.82 58.39,66.67 58.39,67.91 58.58,68.1 v65.91,68.1 | v60.39,62.01 59.44,61.05 ATMEGA.33
  Bottom 0.203: v60.39,62.01 v60.39,65.53 | v65.91,68.1 82.96,68.1 96.11,54.96 100.3,54.96 101.35,53.91 101.35,14.38 96.77,9.81 EXTOUT.3
A5  (via drill 0.3)
  Top 0.203: v58.1,60.29 59.34,60.29 ATMEGA.32 | v57.15,70.39 56.01,71.53 56.01,73.53 53.05,76.49 v51.72,76.49 | v38.48,76.49 38.2,76.49 36.2,74.48 36.2,74.01 35.15,72.96 33.62,72.96 32.58,71.91 JP2.13
  Bottom 0.203: v58.1,60.29 58.1,69.44 v57.15,70.39 | v38.48,76.49 v51.72,76.49
A6  (via drill 0.3)
  Top 0.203: v58.1,59.44 59.34,59.44 ATMEGA.31 | v58.77,72.67 58.77,73.34 v56.01,76.11
  Bottom 0.203: v58.1,59.44 58.77,60.1 v58.77,72.67 | v56.01,76.11 52.2,76.11 51.53,75.44 33.62,75.44 32.58,74.39 JP2.14
A7
  Top 0.203: RA.1 61.5,59.75 60.5,58.75 59.5,58.75 ATMEGA.30
AREF
  Top 0.254: ATMEGA.29 60.55,57.85 60.75,58.05 C4.1
COM
  Top 0.813: J.3 1.9,53.3 4.2,51 4.2,49.25 0.7,45.75 0.7,15.3 3.45,12.55 3.45,8.65 D0.A 3.42,5.78 5.4,3.8 13.4,3.8 COM.1 | COM.2 22.1,3.9 22.6,3.4 TVS0.C
  Bottom 0.813: COM.2 COM.1
D0
  Top 0.203: MICROSD.2 73.34,66.39 73.34,63.82 RSD.1 73.25,63.82 60.77,63.82 56.48,59.53 53.24,59.53 52.77,60.01 52.77,62.77 ATMEGA.40
D1  (via drill 0.3)
  Top 0.203: ATMEGA.41 v52,64.38 52,65.25 51.88,65.38 ROE.1 | v63.62,40.5 59.75,40.5 58.75,41.5 58.75,42 58.12,42.62 74HC595.13
  Bottom 0.203: v63.62,40.5 70,40.5 73.81,36.69 | 73.81,36.69 74.38,36.12 74.38,32.5 92,14.88 94.12,14.88 EXTOUT.8 | v52,64.38 52,69.75 53.75,71.5 53.75,73.5 54.5,74.25 58.12,74.25 59.88,72.5 59.88,66.88 77.12,49.62 77.12,45.88 78.12,44.88 79.12,44.88 80.25,43.75 80.25,43.12 73.81,36.69
D3  (via drill 0.3)
  Top 0.203: v50.12,65.88 50.38,65.62 50.38,62.88 ATMEGA.43 | v50.12,70.88 50.25,71 50.25,77 51.25,78 101.5,78 101.5,18 96.88,13.38 94.25,13.38 94.25,12.38 EXTOUT.6 | v65.5,38.5 60.5,38.5 57.5,41.5 57.5,44 57.75,44.25 58.5,44.25 59.25,43.5 59.25,42.75 74HC595.12
  Bottom 0.203: v50.12,70.88 v50.12,65.88 | v65.5,38.5 91.5,12.5 94,12.5 EXTOUT.6
D4  (via drill 0.3)
  Top 0.203: v52.1,61.53 50.29,61.53 49.62,62.2 49.62,62.77 ATMEGA.44 | v79.63,43.43 80.58,44.39 80.58,44.77 ENC28J60.9
  Bottom 0.203: v52.1,61.53 52.96,61.53 54.1,60.39 54.1,53.53 53.82,53.24 53.82,52.1 56.2,49.72 56.2,47.81 59.53,44.48 78.58,44.48 v79.63,43.43
D12  (via drill 0.3)
  Top 0.203: v50.39,55.91 50.39,51.34 ATMEGA.13
  Bottom 0.203: v50.39,55.91 50.39,57.34 50.1,57.63 50.1,60.1 43.81,66.39 43.05,66.39 37.62,71.82 JP2.17
D13  (via drill 0.3)
  Top 0.203: v51.91,60.01 51.91,57.34 51.24,56.67 51.24,51.34 ATMEGA.14
  Bottom 0.203: v51.91,60.01 50.77,60.01 44.01,66.77 43.72,66.77 38.67,71.82 38.67,73.25 37.62,74.3 JP2.18
D14  (via drill 0.3)
  Top 0.203: v51.91,52.86 51.91,51.34 ATMEGA.15 | v37.72,54.48 37.72,62.2 28.1,71.82 27.53,71.82 JP2.9
  Bottom 0.203: v51.91,52.86 39.34,52.86 v37.72,54.48
D15  (via drill 0.3)
  Top 0.203: v55.15,54.77 52.86,52.48 52.86,51.34 ATMEGA.16 | v56.01,68.29 51.44,68.29 41.81,77.91 32,77.91 28.48,74.39 27.53,74.39 JP2.10
  Bottom 0.203: v55.15,54.77 55.15,57.24 56.29,58.39 56.29,68.01 v56.01,68.29
D18  (via drill 0.3)
  Top 0.203: v50.67,48.86 55.05,48.86 56.77,50.58 56.77,51.24 ATMEGA.21 | v38.39,50.77 38.39,63.82 36.58,65.63 36.58,72.29 37.53,73.25 38.01,73.25 39.05,74.3 39.05,74.77 39.72,75.44 40.58,75.44 41.24,74.77 41.24,72.96 40.2,71.91 JP2.19
  Bottom 0.203: v50.67,48.86 40.29,48.86 v38.39,50.77
D19
  Top 0.203: ATMEGA.22 57.53,51.24 57.53,50.58 55.15,48.2 42.67,48.2 38.77,52.1 38.77,64.01 37.05,65.72 37.05,69.72 39.05,71.72 39.05,73.25 40.1,74.3 JP2.20
D20  (via drill 0.3)
  Top 0.203: v59.24,52.29 59.34,52.39 59.34,52.96 ATMEGA.23 | v56.1,57.24 54.77,58.58 v54.77,58.86 | v48.48,66.1 42.77,71.82 JP2.21
  Bottom 0.203: v59.24,52.29 59.24,54.1 v56.1,57.24 | v54.77,58.86 54.77,60.29 51.82,63.25 50.67,63.25 48.48,65.44 v48.48,66.1
D21
  Top 0.203: ATMEGA.24 59.38,53.75 58.25,53.75 58.25,49.38 56.88,48 56.88,42.75 74HC595.14
D22  (via drill 0.3)
  Top 0.203: ATMEGA.25 59.5,54.62 60.62,54.62 60.62,42.75 74HC595.11 60.75,42.62 60.75,41.5 v61.12,41.12
  Bottom 0.203: v61.12,41.12 62.38,39.88 63.12,39.88 93.25,9.75 94.12,9.75 EXTOUT.4
D23  (via drill 0.3)
  Top 0.203: v51.91,55.44 59.34,55.44 ATMEGA.26 | v41.72,56.48 41.72,60.29 39.15,62.87 39.15,64.2 37.43,65.91 37.43,67.63 41.62,71.82 41.62,73.25 42.67,74.3 JP2.22
  Bottom 0.203: v51.91,55.44 51.72,55.44 49.91,53.63 48.58,53.63 45.72,56.48 v41.72,56.48
D+
  Top 0.203: CH340.5 18,38.67 17.43,38.1 17.43,38.01 17.24,37.81 11.43,37.81 9.91,39.34 8.67,39.34 7.53,38.2 USB.D+
D-
  Top 0.203: CH340.6 19.24,38.67 18.67,38.1 18.67,38.01 18.1,37.43 10.19,37.43 9.53,38.1 USB.D-
GND  (via drill 0.3)
  Top 0.203: MICROSD.P$1 66.67,76.49 70.48,76.49 70.96,76.01 81.63,76.01 82.11,76.49 MICROSD.P$2 82.2,76.49 85.63,76.49 94.01,68.1 99.44,68.1 99.73,68.39 B1.2 99.82,68.39 100.97,67.25 100.97,63.34 99.82,62.2 99.82,58.29 B2.2 99.82,58.2 99.82,55.44 100.97,54.29 100.97,49.24 99.82,48.1 B3.2 99.73,48.01 99.44,47.72 96.68,47.72 92.2,52.2 92.2,57.34 C7.1 | RBS.1 89.82,46.01 84.01,46.01 83.25,45.24 83.25,44.86 ENC28J60.11 83.15,44.77 82.77,44.39 82.77,42.39 C6.1 82.62,42.25 81.62,41.25 81.62,36.38 | 78.54,34.75 78.54,31.55 77.59,30.59 CS.2 77.5,30.38 77.5,29.5 69.72,29.5 69.38,29.85 69.38,31 62.38,31 62.19,31.19 | 78.54,34.75 78.54,34.78 77.59,35.74 RD.1 | RJ45.G- 100.01,21.53 100.01,29.53 RJ45.Y- | 12.95,38.67 CH340.1 12.86,38.67 v11.62,38.67 | MICROSD.GND1 82.11,67.15 81.82,67.15 81.44,67.53 78.3,67.53 77.72,66.96 77.72,66.48 MICROSD.6 77.63,66.96 77.06,67.53 71.63,67.53 71.06,66.96 67.63,66.96 MICROSD.GND3 67.53,66.86 62.58,66.86 60.48,64.77 58.67,64.77 57.82,65.63 57.82,72.1 57.53,72.39 RF.3 | ATMEGA.39 53.53,62.87 53.44,62.96 53.44,65.25 52.48,66.2 51.24,66.2 50.96,66.48 50.96,67.72 51.15,67.91 52.48,67.91 53.15,67.25 54.29,67.25 C5.2 54.39,67.25 55.34,67.25 v55.53,67.44 | 63.44,57.05 63.44,58.01 C4.2 63.44,58.1 62.58,58.96 62.58,60.39 62.87,60.67 64.01,60.67 67.91,56.77 | 63.44,57.05 63.44,56.1 C3.2 | 63.44,57.05 59.44,57.05 ATMEGA.28 59.34,57.05 58.77,57.05 57.15,58.67 v55.63,58.67 | C8.2 22.95,49.62 14.29,49.62 11.24,46.58 10.95,46.58 C10.1 11.24,46.48 11.24,44.67 14.43,41.48 | 31.23,43.9 DS1307.4 30.77,43.34 30.77,35.72 32,34.48 C1.-
  Top 0.203: 31.23,43.9 33.62,46.29 33.62,47.72 24AA.2 | v35.34,30.67 35.34,30.77 35.46,30.89 | 14.43,41.48 14.86,41.05 19.53,41.05 21.24,39.34 21.24,36.48 X.2 | v14.38,41.34 14.38,41.43 14.43,41.48 | C9.2 52.25,41.62 49.12,44.75 36.25,44.75 36.25,44.38 35.75,43.88 31.25,43.88 31.23,43.9 | 75,38 75,37.38 76.5,35.88 76.6,35.85 | 75,38 75,40.75 72.38,43.38 72.38,44.25 71.88,44.75 ENC28J60.2 | 62.19,31.19 62.12,31.25 62.12,31.75 58.75,35.12 58.75,37.88 62.38,37.88 62.62,37.62 62.62,37.12 63.12,36.62 74HC595.8 | 78.54,34.75 81.5,34.75 TVSS.A 81.62,34.75 81.62,36.38 | 75,38 70.75,38 70.38,38.38 70.38,40.88 CV.2 66.5,44.88 68.62,47 68.62,52.12 C12.2 68.58,52.2 67.91,52.86 67.91,56.77 | 1117.1 40.12,34.75 44.62,30.25 47.25,30.25 48,31 62.12,31 62.12,31.12 62.19,31.19 | 81.62,36.38 85.25,32.75 85.25,30.75 86,30 RJ45.GND | RJ45.SHIELD1 90.15,15.57 RS.1 90,14.75 88.75,13.5 v88.75,12.5 | v54.48,53.05 54.48,51.34 ATMEGA.18 | 79.63,55.53 79.63,54.77 79.34,54.48 ENC28J60.21 79.34,54.39 78.2,54.39 ENC28J60.22 78.11,54.29 78.11,54.01 77.34,53.24 75.15,53.24 74.96,53.44 74.96,55.34 73.72,56.58 73.72,56.77 CE0.2 73.63,56.77 67.91,56.77 | 79.63,55.53 79.63,56.77 CE1.2 | 79.63,55.53 82.39,55.53 83.15,54.77 83.15,54.39 ENC28J60.18 | 42.72,59.86 42.77,59.91 44.2,59.91 45.05,59.05 CA0.2 45.15,58.96 47.05,57.05 47.72,57.05 ATMEGA.6 | 42.72,59.86 42.39,59.53 42.39,52.29 42.67,52.01 43.91,52.01 44.77,52.86 44.96,52.86 CA1.2 | 42.72,59.86 41.15,61.44 v41.15,65.82
  Top 0.254: LM358.4 75.65,34.9 76.6,35.85 RD.1 | X.2 21.15,35.3 23.25,33.2 25.12,33.2 D2.A
  Top 0.406: RB.2 16.95,30.15 19.1,28 19.9,28 34063.4 20.1,28.05 20.1,28.45 22,30.35 22.5,30.35 CT.2 22.7,30.35 23.4,30.35 25.6,32.55 D2.A 30.48,32.73 C1.- 35.46,30.89 35.5,30.85 CL.2 36.8,31.95 39.55,34.7 1117.1 40,34.9 C2.- | JP2.6 22.4,74.4 22.4,77.05 23.75,78.4 23.75,80.15 U$4.3 | C0.- 12,8.5 9.3,5.8 6.2,5.8 5.35,6.65 5.35,11 5,11.35 5,18.4 PWR.1 | CH.2 21.15,10.25 TVS0.A
  Top 0.61: TVS9.A 78.1,3.75 80.2,1.65 86.38,1.65 RAIN.2
  Top 0.813: CH.2 15.75,10.25 C0.-
  Bottom 0.203: RJ45.GND 86.2,30 87.92,30 91.34,33.43 92.01,33.43 RJ45.SHIELD0 92.11,33.43 95.82,33.43 | 95.82,33.43 99.63,29.62 99.92,29.62 RJ45.Y- | RJ45.SHIELD1 92.11,17.53 96.01,17.53 99.92,21.43 RJ45.G- | B3.2 99.82,48.01 99.82,45.24 100.97,44.1 100.97,38.67 95.82,33.53 95.82,33.43 | 21.91,70.77 25.34,70.77 26,71.44 26,71.91 27.05,72.96 32.96,72.96 34,71.91 35.05,71.91 JP2.15 35.15,71.82 v41.15,65.82 | 21.91,70.77 21.34,71.34 21.34,73.34 22.29,74.3 JP2.6 | 21.91,70.77 21.81,70.77 14.19,63.15 7.05,63.15 LCD.1.GND 6.95,63.05 6.95,62.29 5.81,61.15 5.81,50.01 14.38,41.43 v14.38,41.34 11.72,38.67 v11.62,38.67 9.81,36.86 8.67,36.86 7.53,35.72 USB.GND 7.43,35.62 7.43,30.77 5.71,29.05 5.71,21.34 SP9.2 | v35.34,30.67 37.24,30.67 BAT.P$1 | v88.75,12.5 88.75,4 RAIN.2 | v54.48,53.05 54.48,57.72 55.44,58.67 | 55.44,67.44 55.44,68.01 55.34,68.1 55.34,70.29 RF.3 | 55.44,67.44 55.44,58.67 | v55.53,67.44 55.44,67.44 | v55.63,58.67 55.44,58.67
  Bottom 1.422: SP9.2 3.9,20.7 PWR.1
  pour Top (isolate 0.61): 0,84 104,84 104,0 0,0
  pour Bottom (isolate 1.016): 0,84 104,84 104,0 0,0
INT0  (via drill 0.3)
  Top 0.203: v49.72,54.29 48.48,53.05 47.82,53.05 ATMEGA.11
  Bottom 0.203: v49.72,54.29 49.72,59.91 44.48,65.15 39.91,65.15 34.29,70.77 31.05,70.77 30,71.82 JP2.11
INT1
  Top 0.203: RC.1 49.62,49.05 49.62,51.24 ATMEGA.12
INT2
  Top 0.203: ATMEGA.42 51.15,62.87 51.15,64.58 50.77,64.96 50.77,66.1 49.53,67.34 49.53,69.63 41.62,77.53 33.15,77.53 30,74.39 JP2.12
LEDA
  Top 0.203: REA.2 97.25,37.72 101.06,33.91 101.06,20 100.01,18.95 RJ45.G+
LEDB
  Top 0.203: REB.2 97.25,34.86 99.92,32.19 RJ45.Y+
MISO  (via drill 0.3)
  Top 0.203: v78.77,63.63 78.77,66.39 MICROSD.7 | v79.92,49.24 76.87,46.2 76.87,44.86 ENC28J60.6 | 43.34,66.48 45.81,64.01 45.81,61.63 47.15,60.29 47.72,60.29 ATMEGA.2 | 43.34,66.48 38.48,66.48 v38.1,66.1 | v27.43,66.1 23.05,66.1 17.34,71.82 JP2.1 | v44.01,67.44 44.01,67.25 43.34,66.58 43.34,66.48
  Bottom 0.203: v79.92,49.24 79.92,59.15 78.77,60.29 v78.77,63.63 77.44,63.63 75.53,65.53 66.01,65.53 60.67,70.87 60.67,73.34 58.58,75.44 52.1,75.44 51.72,75.06 51.63,75.06 v44.01,67.44 | v27.43,66.1 v38.1,66.1
  Bottom 0.406: JP2.1 17.3,72.75 18.65,74.1 18.65,79.15 18.7,79.2 U$4.5
MOSI  (via drill 0.3)
  Top 0.203: v74.39,64.87 74.39,66.39 MICROSD.3 | v77.72,46.2 77.72,45.24 78.11,44.86 ENC28J60.7 | v22.57,70.1 20.95,71.72 20.95,73.15 19.91,74.2 JP2.4 | ATMEGA.1 47.72,61.05 v46.48,62.29 46.48,62.48 v47.82,63.82
  Top 0.406: JP2.4 19.85,74.4 19.85,77.05 21.25,78.45 21.25,80.15 U$4.2
  Bottom 0.203: v77.72,46.2 77.72,56.58 74.39,59.91 v74.39,64.87 66.1,64.87 60.29,70.67 60.29,73.15 58.39,75.06 52.29,75.06 51.91,74.68 51.82,74.68 47.82,70.67 v47.82,63.82 | v46.48,62.29 42.96,62.29 40.48,64.77 27.91,64.77 v22.57,70.1
N$1
  Bottom 0.813: PWR.2 0.7,18.75 0.7,45.6 4.35,49.25 4.35,53.85 1.9,56.3 J.2
  Bottom 1.422: SP9.1 4,15.7 3.7,16 PWR.2
N$2
  Top 0.61: 34063.8 13.95,24.5 13.95,25.4 14,25.45 13.95,25.5 34063.7 | 34063.1 20.05,24.2 14.2,24.2 34063.8 | RSC.1 13,19.95 RSC1.1 13.93,22.88 34063.8
N$3  (via drill 0.3)
  Top 0.203: v51.38,44.38 51.38,45.5 49.62,47.25 RC.2
  Top 0.61: TVS9.C 74.15,3.8 76.05,5.7 81.75,5.7 RAIN.1
  Bottom 0.203: v51.38,44.38 83.5,12.25 83.5,4 RAIN.1
N$4
  Top 0.203: R6.2 63,32 59.4,35.6 59.4,36.55 74HC595.5
N$5
  Top 0.203: R7.2 64.5,31.85 60.65,35.7 60.65,36.55 74HC595.6
N$6
  Top 0.254: X.1 19.95,38.08 CH340.7
N$7
  Top 0.203: R8.2 66.95,31.85 63.65,35.15 62.5,35.15 61.95,35.7 61.95,36.55 74HC595.7
N$8
  Top 0.254: X0.1 27.35,37.7 27.35,38.7 26.3,39.75 26.3,41.8 26.95,42.45 26.95,43.4 DS1307.1
N$9
  Top 0.406: 21.35,25.45 20.1,25.45 34063.2 | 21.35,25.45 24.6,28.7 25.6,28.7 D2.C | L1.1 22.95,23.7 21.4,25.25 21.35,25.45
N$10
  Top 0.203: R5.2 60.4,31.85 58.4,33.85 58.4,34.6 58.1,34.9 58.1,36.55 74HC595.4
N$11
  Top 0.203: R4.2 58,34.45 56.85,35.6 56.85,36.55 74HC595.3
N$12
  Top 0.203: R3.2 55.5,35.5 55.6,35.6 55.6,36.55 74HC595.2
N$13
  Top 0.203: R2.2 53,34.3 54.3,35.6 54.3,36.55 74HC595.1
N$14
  Top 0.203: R1.2 50.5,36.65 55.6,41.75 55.6,42.7 74HC595.15
N$15
  Top 0.203: CA0.1 43.38,57.08 XA.1 43.35,56.8 44.2,55.95 46.45,55.95 46.75,56.25 ATMEGA.7
N$16
  Top 0.61: T1.4 37.5,22.15 36.35,21 36.35,10.65 TVS1.A
  Top 0.813: TVS1.A 33.3,7.8 33.25,7.75 S12.1
  Bottom 1.422: SP1.2 S12.1
N$17
  Top 0.61: T2.4 44.5,25.2 41,21.7 41,10.3 TVS2.A
  Top 0.813: TVS2.A 38.4,7.8 38.35,7.75 S12.2
  Bottom 1.422: SP2.2 S12.2
N$18
  Top 0.61: T3.4 49.75,25.6 45.65,21.55 45.65,9.95 TVS3.A
  Top 0.813: TVS3.A 43.45,7.8 43.45,3.9 S34.1
  Bottom 1.422: SP3.2 S34.1
N$19
  Top 0.203: CA1.1 43.27,53.08 XA.3 45.65,55.45 ATMEGA.8
N$20
  Top 0.61: T4.4 56.8,25.6 53.9,22.7 51.6,22.7 50.35,21.4 50.35,9.6 TVS4.A
  Top 0.813: TVS4.A S34.2
  Bottom 1.422: SP4.2 S34.2
N$21
  Top 0.406: CT.1 22.7,28.55 20.9,26.75 20.1,26.75 34063.3
N$22
  Top 0.61: T5.4 64.25,25.6 61.55,22.9 56.5,22.9 55,21.4 55,14.2 55.6,13.6 55.6,10.1 TVS5.A
  Top 0.813: TVS5.A 53.55,7.8 53.6,7.75 53.6,3.9 S56.1
  Bottom 1.422: SP5.2 S56.1
N$23
  Top 0.61: T6.4 70.7,25.6 67.6,22.5 63.2,22.5 62,21.3 62,15.6 60.8,14.4 60.8,10.1 TVS6.A
  Top 0.813: TVS6.A 58.6,7.8 58.65,7.75 S56.2
  Bottom 1.422: SP6.2 S56.2
N$24
  Top 0.61: T7.4 79.5,24.8 76,21.3 76,17.7 71.05,12.75 71.05,10.9 70.1,9.95 65.65,9.95 TVS7.A
  Top 0.813: TVS7.A 63.7,7.8 63.75,7.75 S78.1
  Bottom 1.422: SP7.2 S78.1
N$25
  Top 0.61: T8.4 81.65,15.2 80.15,13.7 80.15,9.15 77.9,6.9 68.95,6.9 68.85,6.8
  Top 0.813: TVS8.A 68.8,7.8 68.85,7.75 68.85,6.8 68.85,3.9 S78.2
  Bottom 1.422: SP8.2 S78.2
N$26
  Top 0.406: 34063.6 13.27,26.73 12.85,27.15 7.65,27.15 RI.2
  Top 0.61: RSC.2 11,19.95 RSC1.2 10.85,22.1 10.85,23.75 9.95,24.65 9.95,25.2 8.4,26.75 RI.2
N$27
  Top 0.813: D1.A 7.5,20.9 RI.1
N$28
  Top 0.203: R1.1 48.65,30.15 46.8,28.3 42.95,28.3 39.95,25.3 39.95,19.54 T1.3
N$29
  Top 0.203: R2.1 53,27.8 54.05,26.75 54.05,24.35 53.55,23.85 51.26,23.85 T2.3
N$30
  Top 0.254: X0.4 27.35,40.75 27.35,41.65 28.2,42.5 28.2,43.4 DS1307.2
N$31
  Top 0.203: R3.1 55.5,28.05 56.3,27.25 60.4,27.25 61.2,26.45 61.2,24.55 60.55,23.9 56.3,23.9 53.8,21.4 53.8,19.41 T3.3
N$32
  Top 0.203: R4.1 58,28.9 59.15,27.75 62.5,27.75 63.2,27.05 67.45,27.05 68,26.5 68,24.2 67.6,23.8 63.5,23.8 60.8,21.1 60.8,19.41 T4.3
N$33
  Top 0.203: R5.1 60.85,30.15 63.45,27.55 69.15,27.55 69.7,27 74.4,27 74.85,26.55 74.85,24.15 74.55,23.85 72.26,23.85 T5.3
N$34
  Top 0.203: REA.1 95.54,37.81 95.54,41.24 90.96,45.81 90.96,46.58 85.06,52.48 72.77,52.48 71.82,53.44 71.82,54.29 ENC28J60.27
N$35
  Top 0.203: R6.1 63.15,30.15 65.2,28.1 69.3,28.1 69.85,27.55 74.75,27.55 75.75,26.55 75.75,22.95 74.6,21.8 74.6,19.61 T6.3
N$36  (via drill 0.3)
  Top 0.203: v31.72,46.2 29.53,44.01 29.53,43.43 DS1307.3
  Bottom 0.203: v31.72,46.2 36.86,46.2 37.24,46.58 BAT.P$2
N$37  (via drill 0.3)
  Top 0.203: v94.49,36.2 95.54,36.2 REB.1 | v85.72,46.67 83.34,46.67 78.2,51.82 v77.06,51.82 | v73.15,55.72 73.15,54.48 ENC28J60.26
  Bottom 0.203: v94.49,36.2 94.49,37.91 v85.72,46.67 | v73.15,55.72 v77.06,51.82
N$38
  Top 0.203: R7.1 66.05,30.15 67.25,28.95 68.85,28.95 69.4,28.55 70.05,28.05 76.75,28.05 77.6,27.2 81.25,27.2 82.05,26.4 82.05,19.64 T7.3
N$39
  Top 0.203: CV.1 68.5,44.88 70.5,44.88 ENC28J60.1
N$40
  Top 0.254: X.3 22.35,38.2 CH340.8
N$41
  Top 0.203: CE0.1 73.83,58.58 XE.3 75.55,54.42 ENC28J60.24
N$42
  Top 0.203: CE1.1 77.78,58.58 XE.1 77.55,58.55 76.65,57.65 76.65,54.59 ENC28J60.23
N$43
  Top 0.254: D3.A 70.65,31.1 70.65,32.1 71.85,33.3 LM358.1
N$44
  Top 0.203: R8.1 68.3,30.15 69.9,28.75 78.45,28.75 78.95,28.25 81.3,28.25 83.7,25.85 83.7,19.8 86.7,16.8 86.7,9.44 T8.3
N$54
  Top 0.203: C6.2 82.77,40.67 84.3,40.67 RR-.1 84.39,40.67 85.82,40.67 RR+.2
N$55
  Top 0.406: RT.2 13.78,28.15 34063.5 13.95,28.03 RB.1
N$59
  Top 0.203: RBS.2 89.82,44.01 87.82,44.01 87.06,44.77 ENC28J60.14
OPOUT
  Top 0.203: RD.2 77.75,34 77.75,32.5 CS.1 77.5,32.25 75.75,32.25 75,31.5 | 75,31.5 74.75,31.25 D3.C 75,31.5 | RA.2 63.5,59.75 65.5,57.75 65.5,42.5 73,35 73,34.5 LM358.2 73.25,34.25 73.25,33.25 75,31.5
QH*  (via drill 0.3)
  Top 0.203: v69.38,32.75 69.38,36.5 63.25,42.62 74HC595.9
  Bottom 0.203: v69.38,32.75 94.12,8 94.12,7.25 EXTOUT.2
RD+
  Top 0.203: ENC28J60.13 85.82,44.77 85.82,42.48 RR+.1 85.92,42.39 86.2,42.39 90.58,38.01 90.58,34.77 89.72,33.91 89.72,24.67 88.68,23.62 RJ45.RD+
RD-
  Top 0.203: ENC28J60.12 84.39,44.77 84.39,42.39 RR-.2 84.39,42.29 85.15,41.53 86.49,41.53 86.77,41.24 86.77,37.72 86.3,37.24 86.3,31.24 87.15,30.38 87.15,28.38 86.2,27.43 RJ45.RD-
RECAC
  Top 0.813: C0.+ 9.47,14.5 D1.C | CH.1 16.55,11.95 C0.+ | D0.C 7.75,8.25 C0.+
RESET  (via drill 0.3)
  Top 0.203: v46.29,58.67 47.72,58.67 ATMEGA.4 | 30.05,64.34 22.57,71.82 22.38,71.82 JP2.5 | 30.05,64.34 v30.29,64.1 | v74.68,42.77 80.2,42.77 81.92,44.48 81.92,44.77 ENC28J60.10 | v19.91,45.62 19.05,46.48 RR.1 | 30.05,64.34 26.29,60.58 v26.29,50.96
  Top 0.254: C11.2 RR.1
  Bottom 0.203: v46.29,58.67 45.62,58.67 40.2,64.1 v30.29,64.1 | v74.68,42.77 73.34,44.1 53.05,44.1 48.67,48.48 39.79,48.48 38.43,49.84 36.13,49.84 33.15,46.86 26.29,46.86 | 26.29,46.86 21.14,46.86 v19.91,45.62 | 26.29,46.86 v26.29,50.96
  Bottom 0.406: JP2.5 22.4,71.85 22.4,72.75 23.75,74.1 23.75,80.15 U$4.7
RTS
  Top 0.254: C11.1 15.45,44.34 CH340.14
RXD  (via drill 0.3)
  Top 0.203: v14.67,58.67 10.1,54.1 10.1,44.77 14.19,40.67 14.19,38.77 CH340.2 | v46.48,54.86 47.53,54.86 47.72,54.67 ATMEGA.9
  Bottom 0.203: v14.67,58.67 27.81,58.67 31.34,55.15 46.2,55.15 v46.48,54.86
SCK  (via drill 0.3)
  Top 0.203: v76.58,63.63 76.58,66.39 MICROSD.5 | v78.58,46.2 78.58,46.01 79.34,45.24 79.34,44.86 ENC28J60.8 79.34,44.77 79.34,44.39 78.39,43.43 v73.15,43.43 | v42.86,60.58 45.05,60.58 46.1,59.53 47.72,59.53 ATMEGA.3 | v22.48,69.25 19.91,71.82 JP2.3 | v40.1,47.81 40.1,48.2 37.05,51.24 v37.05,60.48
  Bottom 0.203: v76.58,63.63 76.58,58.29 78.58,56.29 v78.58,46.2 | 37.05,60.58 34.58,60.58 31.72,57.72 29.34,57.72 22.48,64.58 v22.48,69.25 | 37.05,60.58 v42.86,60.58 | v73.15,43.43 53.15,43.43 48.77,47.81 v40.1,47.81 | v37.05,60.48 37.05,60.58
  Bottom 0.406: JP2.3 19.85,71.85 19.85,72.75 21.2,74.1 21.2,79.15 21.25,79.2 21.25,80.15 U$4.6
SCL  (via drill 0.3)
  Top 0.203: v54.48,50.01 54.58,50.01 55.15,50.58 55.15,51.24 ATMEGA.19 | 31.91,47.8 v31.91,48.58 | v35.53,52.29 35.53,59.72 23.81,71.44 23.81,72.2 24.86,73.25 24.86,74.2 JP2.8
  Top 0.254: RCL.1 29.45,52.25 29.5,52.2 29.5,49.6 DS1307.6 29.5,49.45 29.5,48.7 v30.1,48.1 30.4,47.8 31.91,47.8 24AA.1
  Top 0.406: JP2.8 24.95,74.4 24.95,77.05 26.3,78.4 U$4.4
  Bottom 0.203: v54.48,50.01 52.29,52.2 35.53,52.2 | v31.91,48.58 35.53,52.2 | v30.1,48.1 22.77,55.44 7.05,55.44 LCD.4.SCL | v35.53,52.29 35.53,52.2
SDA  (via drill 0.3)
  Top 0.203: v51.24,50.01 52.01,49.24 54.67,49.24 55.91,50.48 55.91,51.24 ATMEGA.20 | JP2.7 24.96,71.82 24.96,70.87 36.2,59.63 36.2,50.56 v36.21,50.56 34.6,48.95 34.6,48.85
  Top 0.254: RDA.1 30.8,52.25 30.75,52.2 30.75,49.6 DS1307.5 30.85,49.5 31.9,49.5 32.55,48.85 34.35,48.85 34.6,48.85 34.6,48.6 24AA.3
  Bottom 0.203: v51.24,50.01 50.96,50.01 49.53,51.44 37.08,51.44 v36.21,50.56 33.62,47.98 33.62,47.91 31.72,47.91 21.62,58.01 7.05,58.01 LCD.3.SDA
  Bottom 0.406: JP2.7 24.95,71.85 24.95,72.75 26.3,74.1 U$4.8
SENSE  (via drill 0.3, 0.8)
  Top 0.203: v75,35.88 75,34.88 74.5,34.38 LM358.3 | v81.25,32 81.5,31.75 81.5,30.38 TVSS.C
  Top 0.254: TVSS.C 81.55,29.45 84.95,26.05 84.95,21.65 86.65,19.95 86.65,18.25 87.95,16.95 87.95,10.8 89.78,8.97
  Top 1.12: T1.1 35.19,17.39 v35.15,17.35 | T2.1 v42.19,17.51 v42.2,17.5 | T3.1 49.19,17.46 v49.2,17.45 | T4.1 v56.19,17.41 v56.2,17.4 | T5.1 63.19,17.64 v63.15,17.6 | T6.1 70.19,17.46 v70.2,17.45 | T7.1 77.19,17.21 v77.2,17.2 | v81.6,11.7 81.64,11.66 T8.1 81.64,7.71 82.9,6.45 87.25,6.45 89.78,8.97 RS.2 90.15,7.1 92.85,4.4 97.35,4.4 99.2,6.25 99.2,9.84 EXTOUT.5
  Top 1.422: v33.3,14.9 33.3,12.4 TVS1.C | v38.3,14.9 38.3,12.4 TVS2.C | v43.4,14.9 43.4,12.3 TVS3.C | v48.5,14.8 TVS4.C | v53.6,14.8 53.6,12.5 TVS5.C | v58.6,14.8 58.6,12.3 TVS6.C | v63.7,14.7 63.7,12.4 TVS7.C | v68.8,14.7 68.8,12.5 TVS8.C
  Bottom 0.203: v75,35.88 77.38,35.88 v81.25,32
  Bottom 1.12: v35.15,17.35 35.15,15 35.25,14.9 | v42.2,17.5 42.2,14.95 42.15,14.9 | v49.2,17.45 49.2,15.85 50.15,14.9 | v56.2,17.4 56.2,14.8 | v63.15,17.6 63.15,15.5 62.45,14.8 | v68.8,14.7 70.2,16.1 v70.2,17.45 70.45,17.2 v77.2,17.2 81.6,12.8 v81.6,11.7
  Bottom 1.27: 68.85,12.5 SP8.1 | v33.3,14.9 35.25,14.9 v38.3,14.9 42.15,14.9 v43.4,14.9 48.4,14.9 | 48.4,14.9 v48.5,14.8 | 48.4,14.9 50.15,14.9 53.5,14.9 v53.6,14.8 56.2,14.8 v58.6,14.8 62.45,14.8 63.6,14.8 | 63.6,14.8 v63.7,14.7 | 63.6,14.8 68.7,14.8 v68.8,14.7
  Bottom 1.422: EXTOUT.5 96.8,12.3 96.8,14.8 EXTOUT.7 | SP1.1 33.26,14.86 v33.3,14.9 | SP2.1 38.34,14.86 v38.3,14.9 | SP3.1 43.42,14.88 v43.4,14.9 | SP4.1 v48.5,14.8 | SP5.1 53.58,14.78 v53.6,14.8 | SP6.1 58.66,14.74 v58.6,14.8 | SP7.1 63.74,14.66 v63.7,14.7 | SP8.1 68.82,14.68 v68.8,14.7
TCT  (via drill 0.3)
  Top 0.203: L2.1 92.3,61.05 92.2,60.96 92.2,59.15 C7.2 92.11,59.05 89.72,59.05 RT-.1 89.63,59.05 87.63,59.05 RT+.2 87.53,58.96 v85.06,56.48
  Bottom 0.203: v85.06,56.48 85.06,26.96 86.11,25.91 86.11,24.95 RJ45.P4
TD+
  Top 0.203: ENC28J60.17 84.49,54.77 86.96,57.24 87.53,57.24 RT+.1 87.63,57.34 88.39,58.1 90.39,58.1 91.34,57.15 91.34,46.01 96.39,40.96 96.39,37.15 96.2,36.96 93.34,36.96 90.49,34.1 90.49,23.91 88.68,22.1 88.68,21.14 RJ45.TD+
TD-  (via drill 0.3)
  Top 0.203: 86.58,55.53 87.34,55.53 89.06,57.24 89.63,57.24 RT-.2 | 86.58,55.53 85.82,54.77 85.82,54.39 ENC28J60.16 | 86.58,55.53 v86.58,55.82
  Bottom 0.203: v86.58,55.82 85.25,57.15 84.87,57.15 84.39,56.67 84.39,25.05 86.11,23.34 86.11,22.38 RJ45.TD-
TXD  (via drill 0.3)
  Top 0.203: v16.1,39.72 15.53,39.15 15.53,38.77 CH340.3 | v35.53,44.58 38.1,47.15 40.29,47.15 40.77,47.62 40.77,49.24 v40.48,49.53 | v43.15,49.53 46.77,53.15 46.77,53.44 47.15,53.82 47.72,53.82 ATMEGA.10
  Bottom 0.203: v16.1,39.72 30.67,39.72 v35.53,44.58 | v43.15,49.53 v40.48,49.53
VCC  (via drill 0.3)
  Top 0.203: C12.1 68.77,53.91 70.1,53.91 70.48,54.29 ENC28J60.28 70.58,54.39 70.58,54.77 71.09,55.28 | 71.09,55.28 71.34,55.53 72.3,55.53 72.39,55.44 72.39,53.44 72.58,53.24 73.53,53.24 74.3,54.01 74.3,54.29 ENC28J60.25 74.11,53.72 74.96,52.86 79.53,52.86 80.58,53.91 80.58,54.29 ENC28J60.20 81.92,54.39 ENC28J60.19 82.01,54.29 82.01,54.01 82.77,53.24 83.82,53.24 | 83.82,53.24 86.2,53.24 86.96,54.01 86.96,54.29 ENC28J60.15 | MICROSD.4 75.44,66.39 75.15,66.1 75.15,63.82 RSD.2 75.25,63.82 75.53,63.82 76.39,62.96 79.82,62.96 80.15,63.29 | 83.06,68.2 84.01,68.2 89.06,63.15 L2.2 | 83.06,68.2 66.86,68.2 66.01,67.34 59.34,67.34 RPR.2 | 80.15,63.29 83.06,66.2 83.06,68.2 | 83.82,53.24 83.82,56.29 83.92,56.39 83.92,59.53 80.15,63.29 | C10.2 12.76,46.48 13.72,47.43 19.72,47.43 20.48,46.67 20.67,46.67 RR.2 20.77,46.67 27.15,46.67 28.86,48.39 28.86,50.67 28.48,51.05 28.48,52.86 28.67,53.05 31.53,53.05 34.1,50.48 34.58,50.48 24AA.4 | v16.76,40.39 16.76,38.77 CH340.4 | v14,43.15 12.95,44.2 CH340.16 | 71.09,55.28 71.12,55.25 71.12,40.12 71.75,39.5 LM358.8 71.62,39.5 71.62,39.25 v71,38.62 | C3.1 61.88,56 61.88,42.75 74HC595.10 62,42.62 62,41.38 63.62,41.38 v66.38,38.62 | 46.19,38.31 46.25,38.25 46.25,34.12 1117.4 | 46.19,38.31 44.88,39.62 C2.+ 44.75,39.75 43.65,40.95 37.52,40.95 35.95,41.92 35.45,42.25 v32.38,42.25 | 53.62,43.25 54.25,43.25 54.25,42.75 74HC595.16 54.25,42.62 54.25,42.12 51.62,39.5 51.62,38.38 46.25,38.38 46.19,38.31 | 53.62,43.25 52.25,43.25 C9.1 | v53.62,49.88 53.62,51.25 ATMEGA.17 | 53.62,43.25 v53.62,47.38 | v50.75,57.88 48.88,57.88 | 48.88,57.88 47.88,57.88 ATMEGA.5
  Top 0.203: v39.75,68.12 44.27,68.12 45.88,66.62 48.5,64 48.5,61.75 48.88,61.38 48.88,57.88 | v53.38,60.25 54.25,61.12 54.25,62.62 54.38,62.75 ATMEGA.38 | v53.38,56.12 59.38,56.12 ATMEGA.27
  Top 0.254: C10.2 12.65,44.6 CH340.16 | ATMEGA.38 54.4,64.4 54.3,64.5 C5.1 54.2,65.55 52.65,67.1 ROE.2 | ATMEGA.27 61.7,56.25 61.75,56.2 61.75,56.05 C3.1
  Top 0.305: 46.3,34 1117.4
  Bottom 0.203: v14,43.15 v16.76,40.39 16.88,40.5 30.62,40.5 v32.38,42.25 | EXTOUT.1 96.75,7.25 96.75,8.25 95.38,9.62 95.38,12.62 94.25,13.75 92.5,13.75 71,35.25 v71,38.62 v66.38,38.62 | v53.62,47.38 53.62,48.25 | 53.62,48.25 v53.62,49.88 | 52.81,55.56 53.38,55 53.38,52 55.12,50.25 55.12,49.75 53.62,48.25 | 52.81,55.56 50.75,57.62 | v39.75,68.12 36.5,71.38 36.5,72 35.12,73.38 35.12,74.25 JP2.16 | 50.75,57.62 v53.38,60.25 | 50.75,57.62 v50.75,57.88 | 52.81,55.56 v53.38,56.12
VIN  (via drill 0.3)
  Top 0.305: 13.72,60.58 24.57,49.72 C8.1 25.7,49.7 25.8,49.6 26.9,49.6 DS1307.8 26.96,49.72 26.96,52.01 28.86,53.91 29.24,53.91 RCL.2 RDA.2 30.96,54.01 v34.1,57.15 | 8.29,60.58 7.05,60.58 LCD.2.VDD | 8.29,60.58 13.72,60.58 | 13.72,60.58 15.72,62.58 15.72,71.82 17.24,73.34 17.24,74.2 JP2.2 | 8.29,60.58 8.29,43.53 6.29,41.53 6.29,37.62 6.95,36.96 7.91,36.96 9.14,35.72 9.34,35.72 USB.VBUS | v49.72,65.06 49.72,64.48 48.96,63.72 48.96,61.91 51.44,59.44 51.44,57.63 50.96,57.15 v49.05,57.15
  Top 0.406: 1117.3 38.96,29.15 CL.1 36.45,29.5 C1.+ 32.05,21.9 L1.2 28.2,18.05 12.25,18.05 12,18.3 | JP2.2 17.3,77.8 18.7,79.2 U$4.1 | USB.VBUS 9.48,31.68 6.5,28.7 5.7,28.7 4.85,27.85 4.85,25.15 6.2,23.8 8.4,23.8 9.55,22.65 9.55,18.6 10,18.15 11.85,18.15 12,18.3 | RT.1 11.55,24.6 12,24.15 12,18.3
  Bottom 0.305: v49.72,65.06 51.05,63.72 52.29,63.72 54.86,66.29 54.86,72.39 RF.2 | v34.1,57.15 v49.05,57.15

### Text on the board
tNames: OpenSprinkler v2.3 AC | www.opensprinkler.com | VIN MSI GND SCL D15 IN2 A06 VCC D13 D19 D23 | DAT VIN GND | MSO SCK RST SDA D14 IN0 A05 GND D12 D18 D20 | PWR | EXTOUT | S1-8 | RAIN